# EAGLE design LEDDriver (EAGLE 6.5.0)
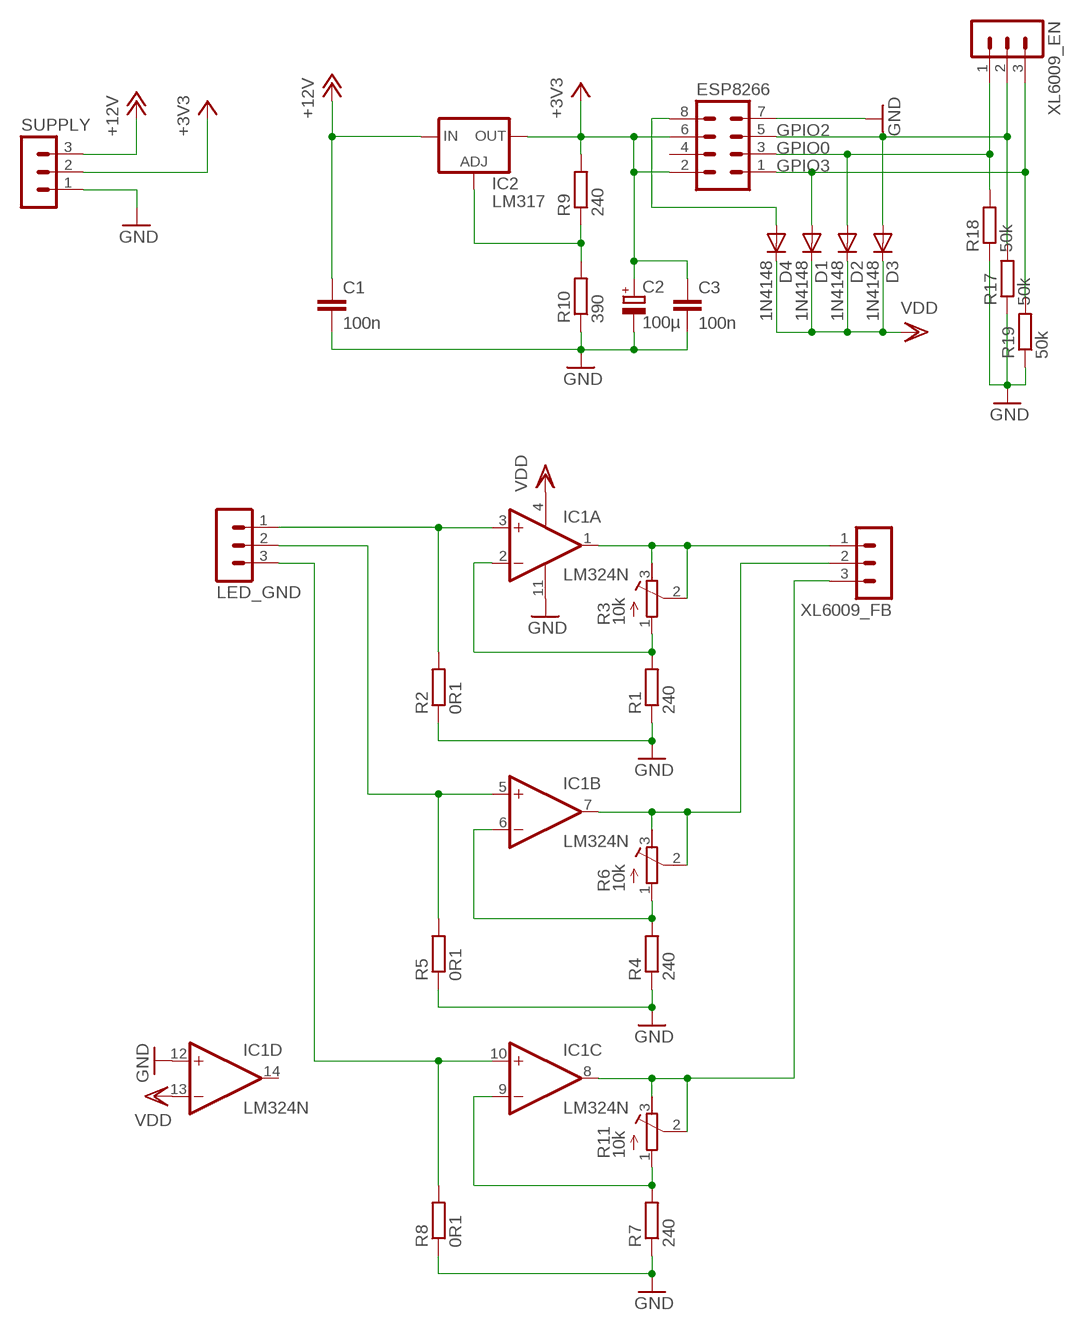
[diagram p0: schematic, sheet 1]

## Parts
C1  100n  C-EU075-032X103  [C075-032X103]
C2  100µ  CPOL-EUE5-8.5  [E5-8,5]
C3  100n  C-EU075-032X103  [C075-032X103]
D1  1N4148  DIODE-D-2.5  [D-2.5]
D2  1N4148  DIODE-D-2.5  [D-2.5]
D3  1N4148  DIODE-D-2.5  [D-2.5]
D4  1N4148  DIODE-D-2.5  [D-2.5]
ESP8266  MA04-2  [MA04-2]
IC1  LM324N  [DIL14]
IC2  LM317  LM317TS  [317TS]
LED_GND  MA03-1  [MA03-1]
R1  240  R-EU_0204/2V  [0204V]
R2  0R1  R-EU_0204/2V  [0204V]
R3  10k  R-TRIMM64W  [RTRIM64W]
R4  240  R-EU_0204/2V  [0204V]
R5  0R1  R-EU_0204/2V  [0204V]
R6  10k  R-TRIMM64W  [RTRIM64W]
R7  240  R-EU_0204/2V  [0204V]
R8  0R1  R-EU_0204/2V  [0204V]
R9  240  R-EU_0204/2V  [0204V]
R10  390  R-EU_0207/12  [0207/12]
R11  10k  R-TRIMM64W  [RTRIM64W]
R17  50k  R-EU_0207/12  [0207/12]
R18  50k  R-EU_0207/12  [0207/12]
R19  50k  R-EU_0207/12  [0207/12]
SUPPLY  MA03-1  [MA03-1]
XL6009_EN  MA03-1  [MA03-1]
XL6009_FB  MA03-1  [MA03-1]

## Nets
+3V3: C2.+ C3.1 ESP8266.2 ESP8266.6 IC2.2(OUT) R9.2 SUPPLY.2
+12V: C1.1 IC2.3(IN) SUPPLY.3
GND: C1.2 C2.- C3.2 ESP8266.7 IC1.11(P:V-) IC1.12(D:+IN) R1.1 R2.1 R4.1 R5.1 R7.1 R8.1 R10.1 R17.1 R18.1 R19.1 SUPPLY.1
GPIO0: D2.A ESP8266.3 R18.2 XL6009_EN.1
GPIO2: D3.A ESP8266.5 R17.2 XL6009_EN.2
GPIO3: D1.A ESP8266.1 R19.2 XL6009_EN.3
N$2: IC1.2(A:-IN) R1.2 R3.1(A)
N$3: IC1.3(A:+IN) LED_GND.1 R2.2
N$4: IC1.1(A:OUT) R3.2(S) R3.3(E) XL6009_FB.1
N$5: IC2.1(ADJ) R9.1 R10.2
N$6: IC1.5(B:+IN) LED_GND.2 R5.2
N$7: IC1.7(B:OUT) R6.2(S) R6.3(E) XL6009_FB.2
N$9: IC1.6(B:-IN) R4.2 R6.1(A)
N$10: IC1.10(C:+IN) LED_GND.3 R8.2
N$11: IC1.8(C:OUT) R11.2(S) R11.3(E) XL6009_FB.3
N$12: IC1.9(C:-IN) R7.2 R11.1(A)
N$23: D4.A ESP8266.8
VDD: D1.C D2.C D3.C D4.C IC1.4(P:V+) IC1.13(D:-IN)
Unconnected: ESP8266.4 IC1.14(D:OUT)

## Library data of the parts
C1 C3 = rcl:C-EU: CAPACITOR, European symbol
C2 = rcl:CPOL-EU: POLARIZED CAPACITOR, European symbol
D1-D4 = diode:DIODE-: DIODE
ESP8266 = con-lstb:MA04-2: PIN HEADER; OC_FARNELL: unknown; OC_NEWARK: unknown
IC1 = linear:LM324: OP AMP
IC2 = v-reg:LM317TS: VOLTAGE REGULATOR
LED_GND SUPPLY XL6009_EN XL6009_FB = con-lstb:MA03-1: PIN HEADER; OC_FARNELL: unknown; OC_NEWARK: unknown
R1 R2 R4 R5 R7-R10 R17-R19 = rcl:R-EU_: RESISTOR, European symbol
R3 R6 R11 = rcl:R-TRIMM: Trimm resistor

## Board
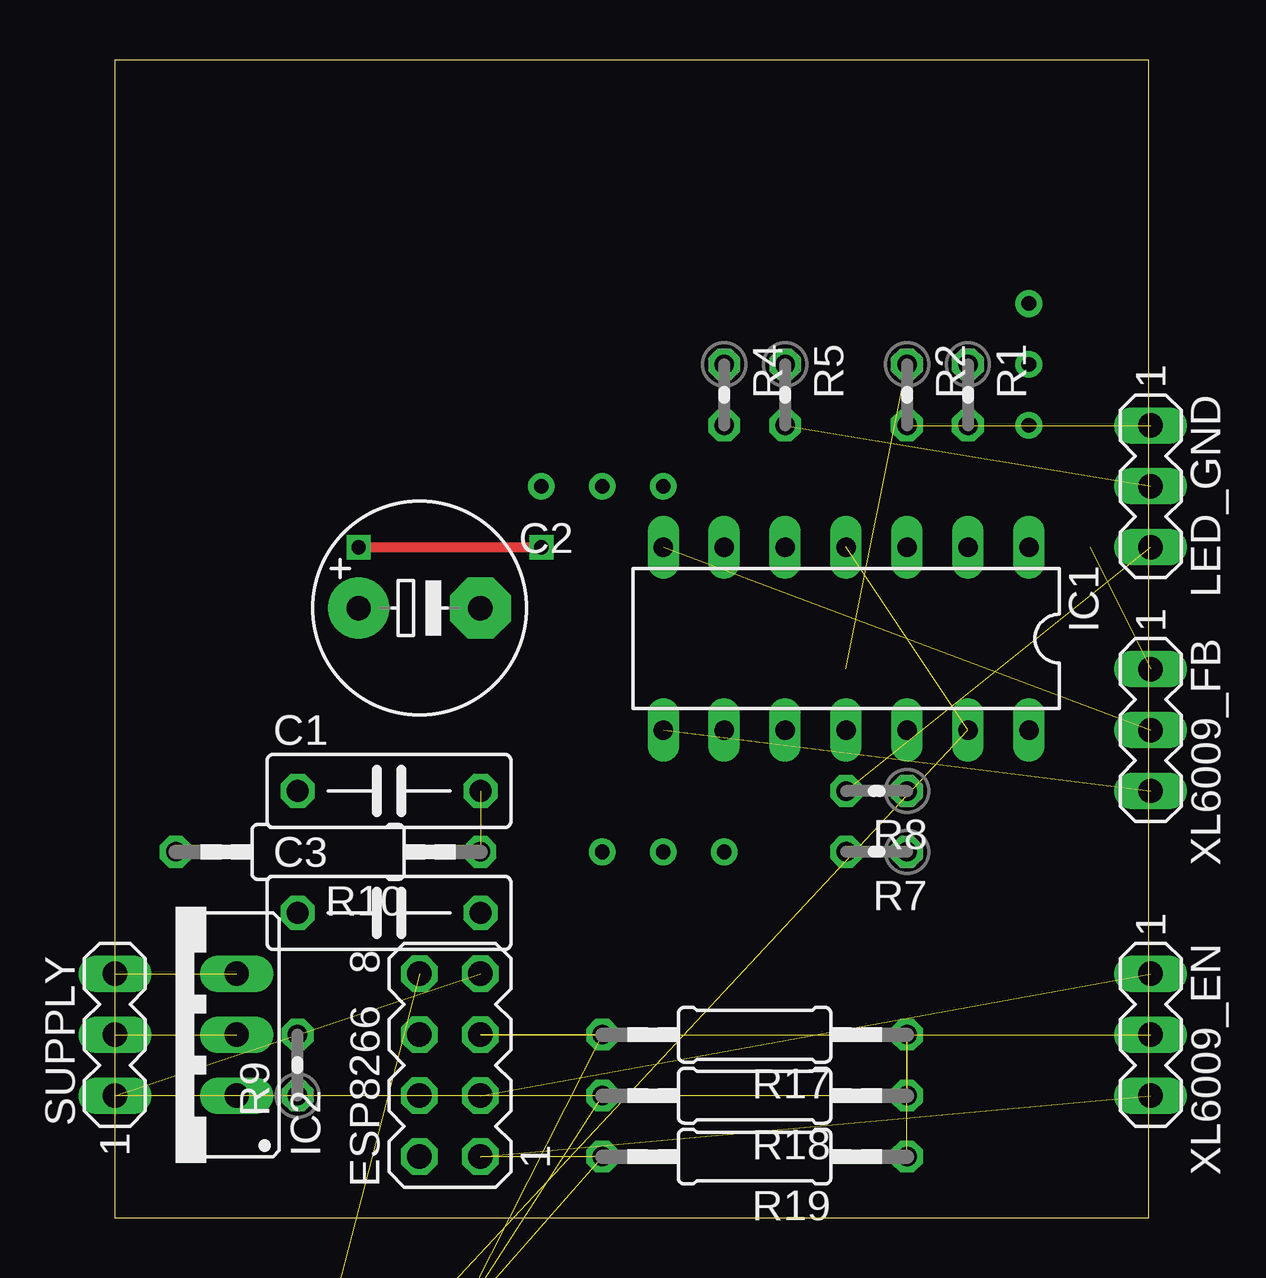
[diagram p1: board, top side]
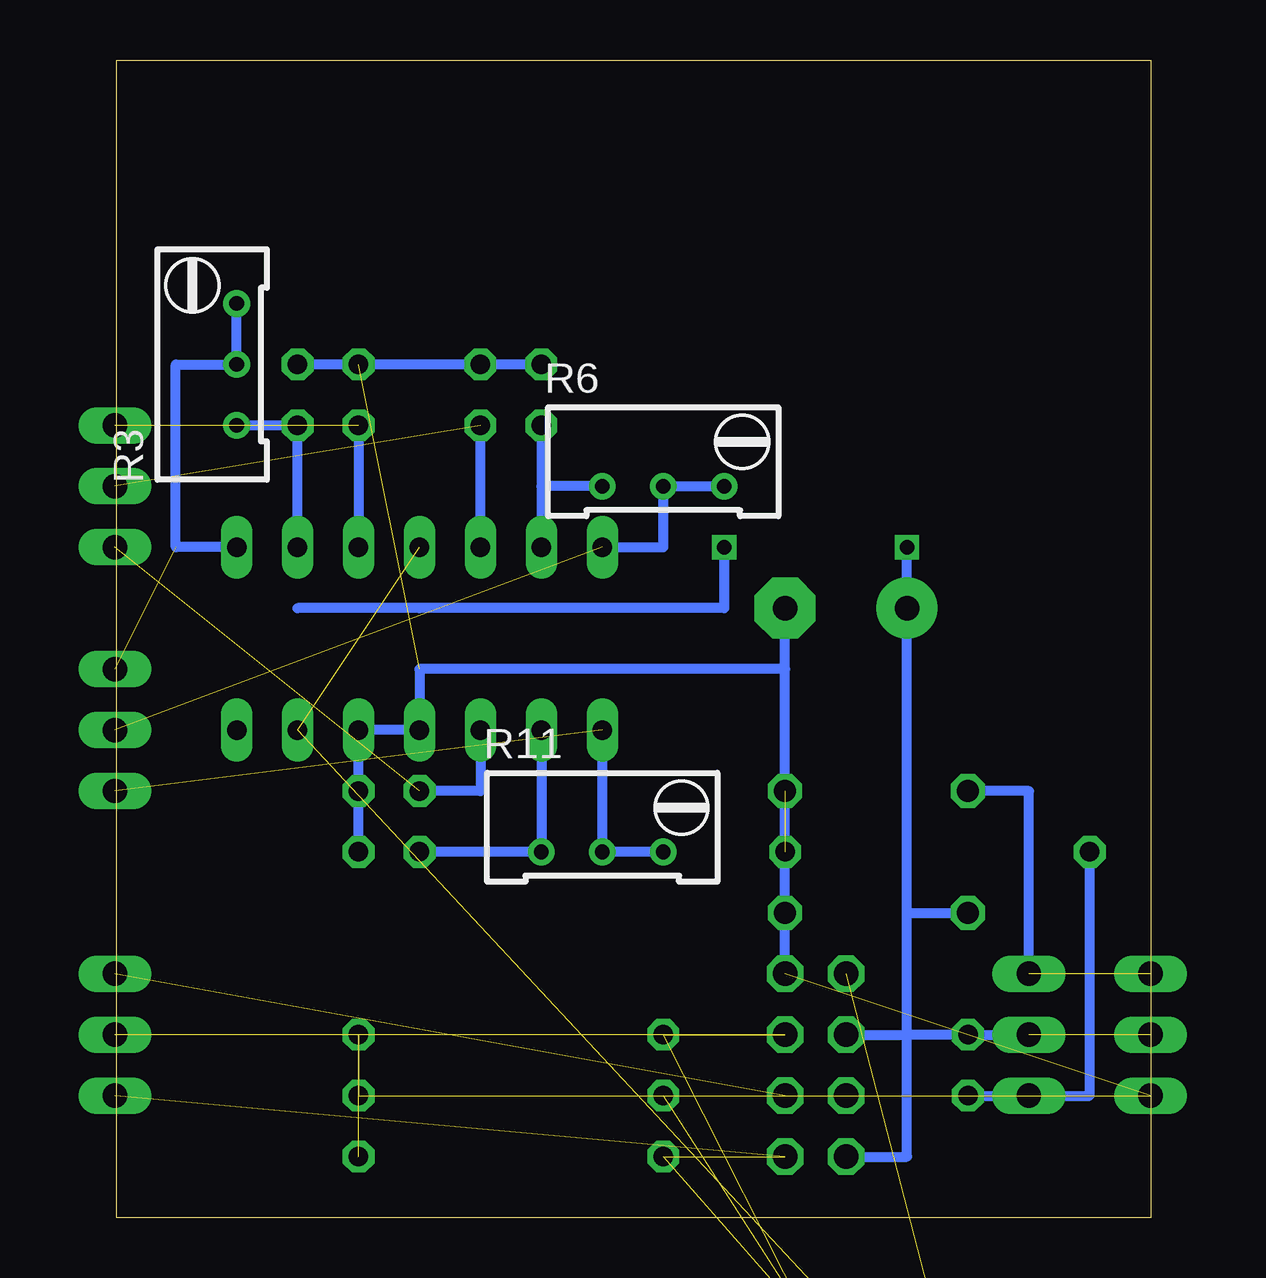
[diagram p2: board, bottom side, seen from below]

Size 43.1 x 48.25 mm. Coordinates in mm from the lower left corner, seen from the top.
Outline: 0,0 43.1,0 43.1,48.25 0,48.25 0,0
Copper layers (1*16): Top 0.035mm / dielectric 1.5mm / Bottom 0.035mm
Design rules "default": minimum track width 10mil, minimum drill 24mil, track to track 8mil, track to pad 8mil, pad to pad 8mil, via to via 8mil, smd to smd 8mil, copper to edge 40mil, drill to drill 8mil, minimum pad ring 10mil, minimum via ring 8mil, stop-mask expansion 4mil, vias tented up to drill 0mil, thermal gap 10mil

### Footprints (pad centres in the part's own frame; a part is rotated, then mirrored left to right if it is on the bottom)
C075-032X103 = drill 0.914 octagon: 1 -3.81,0; 2 3.81,0
E5-8,5 = drill 1.016 pad 2.54: + -2.54,0 | drill 1.016 pad 2.54 octagon: - 2.54,0
D-2.5 = drill 0.813 octagon: A 1.27,0; C -1.27,0
MA04-2 = drill 1.016 octagon: 1 -3.81,-1.27; 2 -3.81,1.27; 3 -1.27,-1.27; 4 -1.27,1.27; 5 1.27,-1.27; 6 1.27,1.27; 7 3.81,-1.27; 8 3.81,1.27
DIL14 = drill 0.813 long: 1 -7.62,-3.81; 2 -5.08,-3.81; 3 -2.54,-3.81; 4 0,-3.81; 5 2.54,-3.81; 6 5.08,-3.81; 7 7.62,-3.81; 8 7.62,3.81; 9 5.08,3.81; 10 2.54,3.81; 11 0,3.81; 12 -2.54,3.81; 13 -5.08,3.81; 14 -7.62,3.81
317TS = drill 1.016 long: 1 -2.54,-2.54; 2 0,-2.54; 3 2.54,-2.54
MA03-1 = drill 1.016 long: 1 -2.54,0; 2 0,0; 3 2.54,0
0204V = drill 0.813 octagon: 1 -1.27,0; 2 1.27,0
RTRIM64W = drill 0.61: 1 1.27,-2.54; 2 1.27,0; 3 1.27,2.54
0207/12 = drill 0.813 octagon: 1 -6.35,0; 2 6.35,0

### Placement (x,y rotation side)
C1  11.43,17.78 0 top
C2  12.7,25.4 0 top
C3  11.43,12.7 0 top
D1  -1.02,-20.32 0 top  (outside the outline)
D2  -1.02,-26.16 0 top  (outside the outline)
D3  -1.02,-32 0 top  (outside the outline)
D4  -1.02,-37.85 0 top  (outside the outline)
ESP8266  13.97,6.35 90 top
IC1  30.48,24.13 180 top
IC2  2.54,7.62 90 top
LED_GND  43.18,30.48 270 top
R1  35.56,34.29 270 top
R2  33.02,34.29 270 top
R3  39.37,35.56 0 bottom
R4  25.4,34.29 270 top
R5  27.94,34.29 270 top
R6  20.32,31.75 270 bottom
R7  31.75,15.24 180 top
R8  31.75,17.78 180 top
R9  7.62,6.35 90 top
R10  8.89,15.24 180 top
R11  22.86,16.51 270 bottom
R17  26.67,7.62 180 top
R18  26.67,5.08 180 top
R19  26.67,2.54 180 top
SUPPLY  0,7.62 90 top
XL6009_EN  43.18,7.62 270 top
XL6009_FB  43.18,20.32 270 top

### Tracks (layer width: path | path; a pad name or v marks a point on that pad's centre or on a via)
+3V3  (via drill 0.6)  (1 unrouted)
  Top 0.406: v10.16,27.94 v17.78,27.94
  Bottom 0.406: IC2.2 R9.2 10.16,7.62 | ESP8266.6 10.16,7.62 | ESP8266.2 10.16,2.54 10.16,7.62 | 10.16,12.7 C2.+ v10.16,27.94 | 10.16,7.62 10.16,12.7 | 10.16,12.7 C3.1 | 35.56,25.4 30.48,25.4 17.78,25.4 v17.78,27.94
+12V  (1 unrouted)
  Bottom 0.406: IC2.3 5.08,17.78 C1.1
GND  (6 unrouted)
  Bottom 0.406: ESP8266.7 R10.1 | C3.2 R10.1 | R10.1 15.24,22.86 | 15.24,22.86 C2.- | R7.1 R8.1 IC1.12 IC1.11 30.48,22.86 15.24,22.86 | R4.1 R5.1 R2.1 R1.1
GPIO0  (3 unrouted)
GPIO2  (3 unrouted)
GPIO3  (3 unrouted)
N$2
  Bottom 0.406: IC1.2 R1.2 R3.1
N$3  (1 unrouted)
  Bottom 0.406: R2.2 IC1.3
N$4  (1 unrouted)
  Bottom 0.406: IC1.1 40.64,27.94 40.64,35.56 R3.2 R3.3
N$5
  Bottom 0.406: R9.1 IC2.1 2.54,5.08 R10.2
N$6  (1 unrouted)
  Bottom 0.406: IC1.5 R5.2
N$7  (1 unrouted)
  Bottom 0.406: IC1.7 20.32,27.94 R6.2 R6.3
N$9
  Bottom 0.406: R4.2 25.4,30.48 | 25.4,30.48 IC1.6 | R6.1 25.4,30.48
N$10  (1 unrouted)
  Bottom 0.406: IC1.10 27.94,17.78 R8.2
N$11  (1 unrouted)
  Bottom 0.406: R11.3 R11.2 IC1.8
N$12
  Bottom 0.406: IC1.9 R11.1 R7.2
N$23  (1 unrouted)
VDD  (5 unrouted)